# EAGLE schematic main (EAGLE 6.6.0)
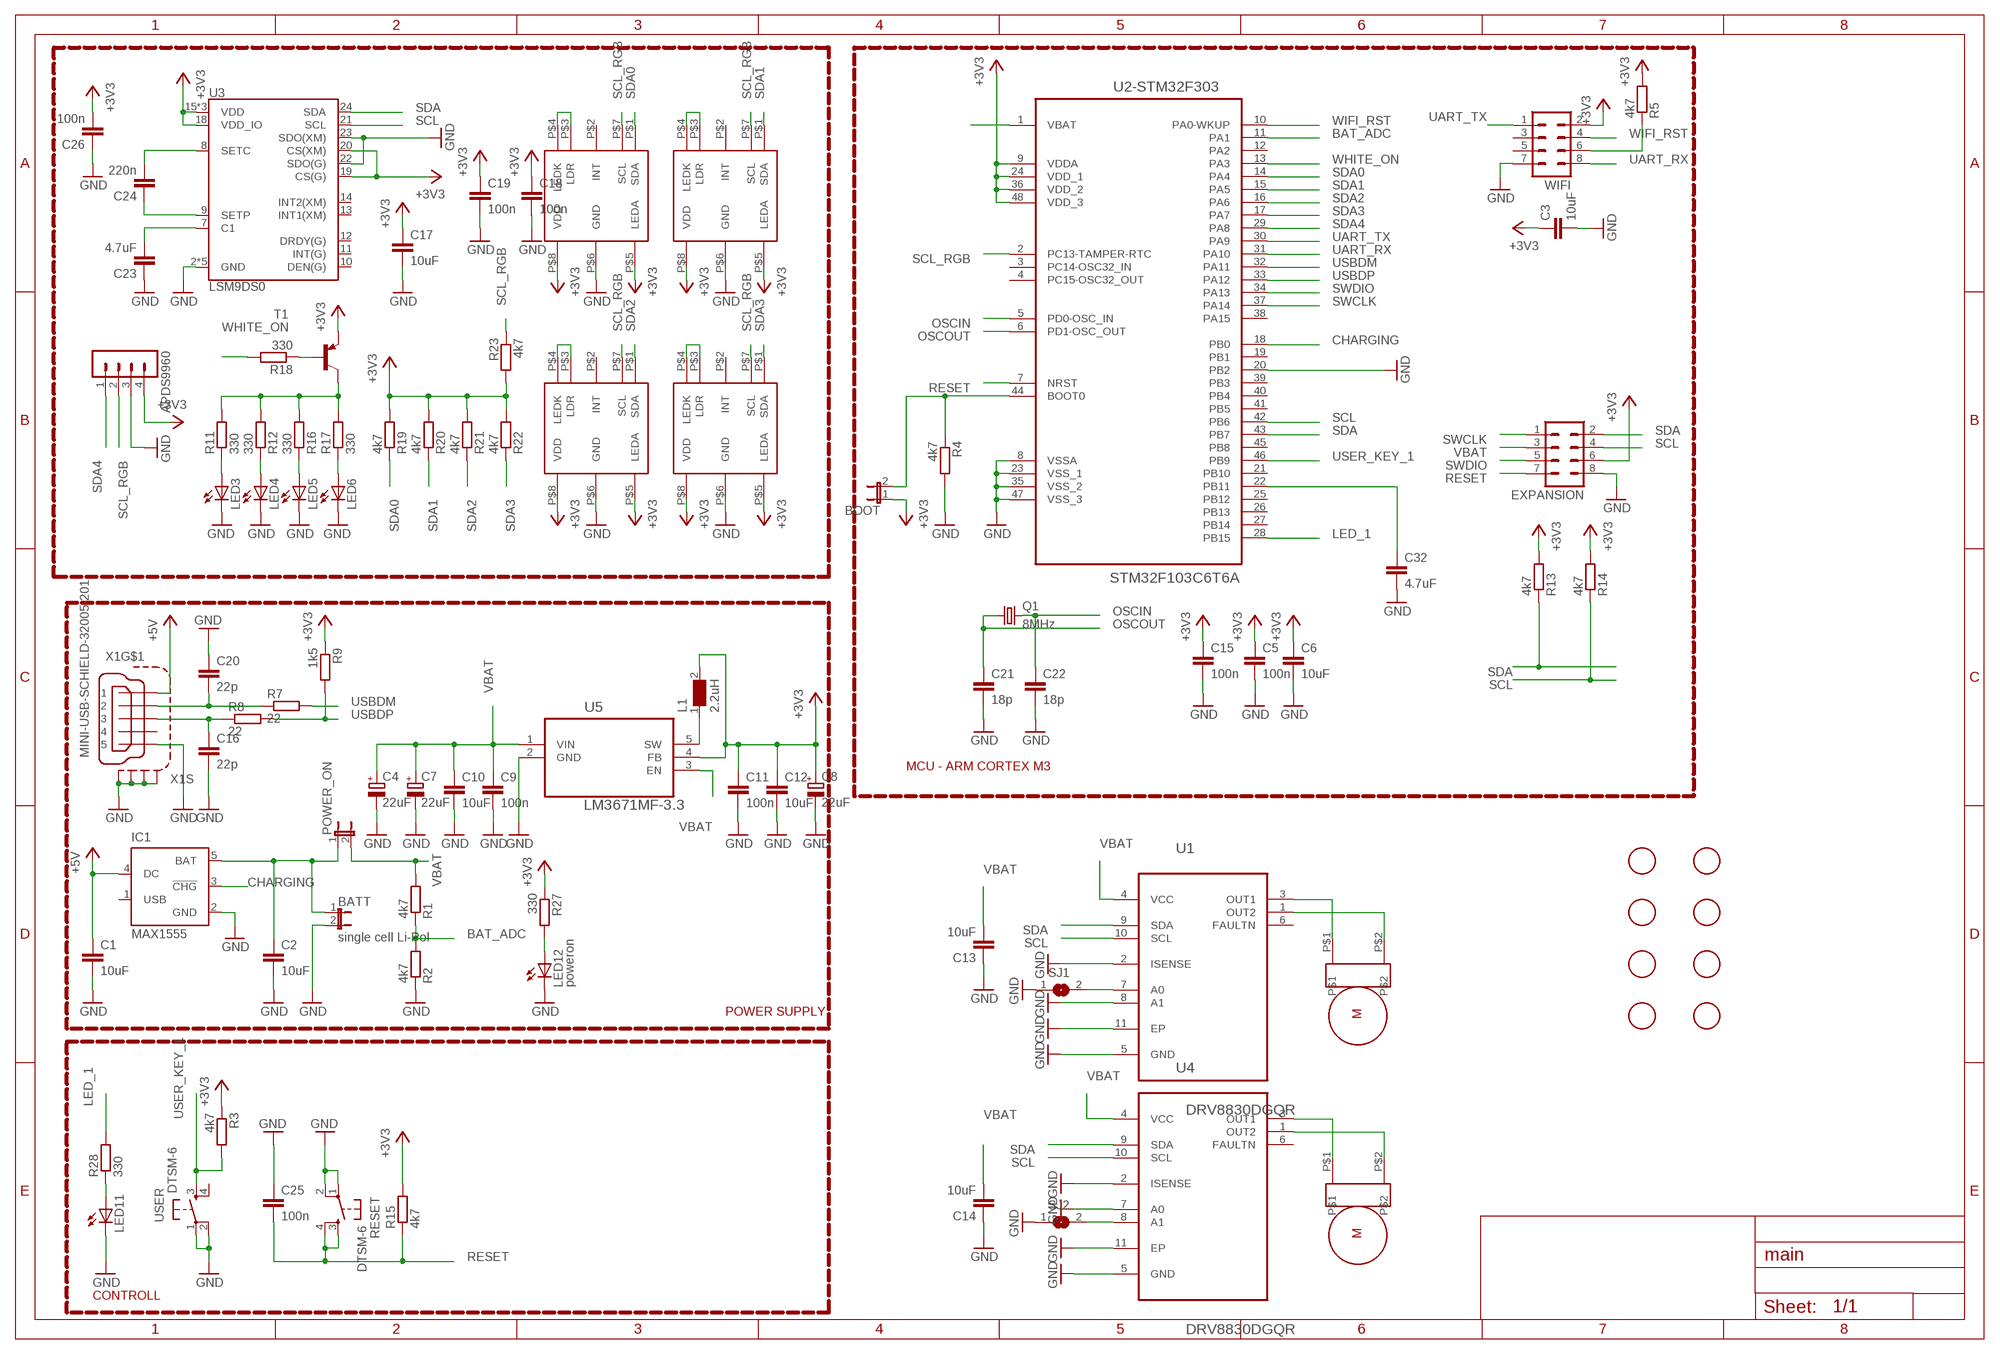
[diagram p0: schematic, sheet 1]

## Parts
APDS9960  MA04-1  [MA04-1]
BATT  single cell Li-Pol  JP1E  [JP1]
BOOT  JP1E  [JP1]
C1  10uF  C-EUC0805  [C0805]
C2  10uF  C-EUC0805  [C0805]
C3  10uF  C-EUC0805  [C0805]
C4  22uF  CPOL-EU153CLV-0505  [153CLV-0505]
C5  100n  C-EUC0805  [C0805]
C6  10uF  C-EUC0805  [C0805]
C7  22uF  CPOL-EU153CLV-0505  [153CLV-0505]
C8  22uF  CPOL-EU153CLV-0505  [153CLV-0505]
C9  100n  C-EUC0805  [C0805]
C10  10uF  C-EUC0805  [C0805]
C11  100n  C-EUC0805  [C0805]
C12  10uF  C-EUC0805  [C0805]
C13  10uF  C-EUC0805  [C0805]
C14  10uF  C-EUC0805  [C0805]
C15  100n  C-EUC0805  [C0805]
C16  22p  C-EUC0805  [C0805]
C17  10uF  C-EUC0805  [C0805]
C18  100n  C-EUC0805  [C0805]
C19  100n  C-EUC0805  [C0805]
C20  22p  C-EUC0805  [C0805]
C21  18p  C-EUC0805  [C0805]
C22  18p  C-EUC0805  [C0805]
C23  4.7uF  C-EUC0805  [C0805]
C24  220n  C-EUC0805  [C0805]
C25  100n  C-EUC0805  [C0805]
C26  100n  C-EUC0805  [C0805]
C32  4.7uF  C-EUC0805  [C0805]
EXPANSION  MA04-2  [MA04-2]
IC1  MAX1555  [SOT23-5L]
L1  2.2uH  WE-LQ-744032002_M  [WE-LQ_M]
LED3  LEDCHIPLED_1206  [CHIPLED_1206]
LED4  LEDCHIPLED_1206  [CHIPLED_1206]
LED5  LEDCHIPLED_1206  [CHIPLED_1206]
LED6  LEDCHIPLED_1206  [CHIPLED_1206]
LED11  LEDCHIPLED_1206  [CHIPLED_1206]
LED12  poweron  LEDCHIPLED_1206  [CHIPLED_1206]
POWER_ON  JP1E  [JP1]
Q1  8MHz  CRYSTALCTS406  [CTS406]
R1  4k7  R-EU_M0805  [M0805]
R2  4k7  R-EU_M0805  [M0805]
R3  4k7  R-EU_M1206  [M1206]
R4  4k7  R-EU_M0805  [M0805]
R5  4k7  R-EU_M0805  [M0805]
R7  22  R-EU_M0805  [M0805]
R8  22  R-EU_M0805  [M0805]
R9  1k5  R-EU_M0805  [M0805]
R11  330  R-EU_M0805  [M0805]
R12  330  R-EU_M0805  [M0805]
R13  4k7  R-EU_M0805  [M0805]
R14  4k7  R-EU_M0805  [M0805]
R15  4k7  R-EU_M0805  [M0805]
R16  330  R-EU_M0805  [M0805]
R17  330  R-EU_M0805  [M0805]
R18  330  R-EU_M0805  [M0805]
R19  4k7  R-EU_M0805  [M0805]
R20  4k7  R-EU_M0805  [M0805]
R21  4k7  R-EU_M0805  [M0805]
R22  4k7  R-EU_M0805  [M0805]
R23  4k7  R-EU_M0805  [M0805]
R27  330  R-EU_M0805  [M0805]
R28  330  R-EU_M0805  [M0805]
RESET  DTSM-6  [DTSM-6]
SJ1  SJ  [SJ]
SJ2  SJ  [SJ]
T1  BC857A-PNP-SOT23-BEC  [SOT23-BEC]
U1  DRV8830DGQR  [SOP65P640X110-15N]
U2-STM32F303  STM32F103C6T6A  [QFP50P900X900X160-48N]
U3  LSM9DS0  [LGA-24]
U4  DRV8830DGQR  [SOP65P640X110-15N]
U5  LM3671MF-3.3  [SOT95P284X122-5N]
U$1  APDS9950  [APDS9950]
U$2  APDS9950  [APDS9950]
U$3  APDS9950  [APDS9950]
U$4  APDS9950  [APDS9950]
U$5  MICRO_METAL_GEAR_MOTOR  [MICRO_METAL_GEAR_MOTOR]
U$6  MICRO_METAL_GEAR_MOTOR  [MICRO_METAL_GEAR_MOTOR]
U$9  FIDUCIAL  [FIDUCIAL_1MM]
U$10  FIDUCIAL  [FIDUCIAL_1MM]
U$11  FIDUCIAL  [FIDUCIAL_1MM]
U$12  FIDUCIAL  [FIDUCIAL_1MM]
U$13  FIDUCIAL  [FIDUCIAL_1MM]
U$14  FIDUCIAL  [FIDUCIAL_1MM]
U$15  FIDUCIAL  [FIDUCIAL_1MM]
U$16  FIDUCIAL  [FIDUCIAL_1MM]
USER  DTSM-6  [DTSM-6]
WIFI  MA04-2  [MA04-2]
X1  MINI-USB-SCHIELD-32005-201  [32005-201]

## Nets
+3V3: APDS9960.4 BOOT.1 C3.1 C5.1 C6.1 C8.+ C11.1 C12.1 C15.1 C17.1 C18.1 C19.1 C26.2 EXPANSION.6 L1.2 R3.1 R5.2 R9.1 R13.2 R14.2 R15.2 R19.2 R20.2 R21.2 R22.2 R23.2 R27.1 T1.E U2-STM32F303.9(VDDA) U2-STM32F303.24(VDD_1) U2-STM32F303.36(VDD_2) U2-STM32F303.48(VDD_3) U3.15(VDD) U3.16(VDD) U3.17(VDD) U3.18(VDD_IO) U3.19(CS(G)) U3.20(CS(XM)) U5.4(FB) U$1.P$5(LEDA) U$1.P$8(VDD) U$2.P$5(LEDA) U$2.P$8(VDD) U$3.P$5(LEDA) U$3.P$8(VDD) U$4.P$5(LEDA) U$4.P$8(VDD) WIFI.2
+5V: C1.1 IC1.4(DC) X1.1
BAT_ADC: R1.1 R2.2 U2-STM32F303.11(PA1)
CHARGING: IC1.3(!CHG) U2-STM32F303.18(PB0)
GND: APDS9960.3 BATT.2 C1.2 C2.2 C3.2 C4.- C5.2 C6.2 C7.- C8.- C9.2 C10.2 C11.2 C12.2 C13.1 C14.1 C15.2 C16.2 C17.2 C18.2 C19.2 C20.1 C21.2 C22.2 C23.1 C25.1 C26.1 C32.2 EXPANSION.8 IC1.2(GND) LED3.C LED4.C LED5.C LED6.C LED11.C LED12.C R2.1 R4.2 RESET.1 RESET.2 SJ1.1 SJ2.1 U1.2(ISENSE) U1.5(GND) U1.8(A1) U1.11(EP) U2-STM32F303.8(VSSA) U2-STM32F303.20(PB2) U2-STM32F303.23(VSS_1) U2-STM32F303.35(VSS_2) U2-STM32F303.47(VSS_3) U3.2(GND) U3.3(GND) U3.4(GND) U3.5(GND) U3.6(GND) U3.22(SDO(G)) U3.23(SDO(XM)) U4.2(ISENSE) U4.5(GND) U4.7(A0) U4.11(EP) U5.2(GND) U$1.P$6(GND) U$2.P$6(GND) U$3.P$6(GND) U$4.P$6(GND) USER.1 USER.2 WIFI.7 X1.5 X1.M1(S:S1) X1.M2(S:S2) X1.M3(S:S3) X1.M4(S:S4)
LED_1: R28.2 U2-STM32F303.28(PB15)
N$1: R5.1 WIFI.6
N$2: BATT.1 C2.1 IC1.5(BAT) POWER_ON.1
N$3: U1.1(OUT2) U$5.P$2
N$4: U1.3(OUT1) U$5.P$1
N$5: U4.1(OUT2) U$6.P$2
N$6: C23.2 U3.7(C1)
N$7: C24.2 U3.8(SETC)
N$8: U4.3(OUT1) U$6.P$1
N$9: L1.1 U5.5(SW)
N$13: C24.1 U3.9(SETP)
N$14: C32.1 U2-STM32F303.22(PB11)
N$15: LED3.A R11.1
N$16: BOOT.2 R4.1 U2-STM32F303.44(BOOT0)
N$17: U$1.P$3(LDR) U$1.P$4(LEDK)
N$18: U$2.P$3(LDR) U$2.P$4(LEDK)
N$19: U$3.P$3(LDR) U$3.P$4(LEDK)
N$20: U$4.P$3(LDR) U$4.P$4(LEDK)
N$21: SJ1.2 U1.7(A0)
N$22: LED4.A R12.1
N$23: LED12.A R27.2
N$24: LED5.A R16.1
N$25: LED6.A R17.1
N$26: R11.2 R12.2 R16.2 R17.2 T1.C
N$27: R18.1 T1.B
N$28: SJ2.2 U4.8(A1)
N$33: LED11.A R28.1
N$55: C20.2 R7.1 X1.2
N$56: C16.1 R8.1 X1.3
NC: U2-STM32F303.1(VBAT)
OSCIN: C22.1 Q1.3 U2-STM32F303.5(PD0-OSC_IN)
OSCOUT: C21.1 Q1.1 U2-STM32F303.6(PD1-OSC_OUT)
RESET: C25.2 EXPANSION.7 R15.1 RESET.3 RESET.4 U2-STM32F303.7(NRST)
SCL: EXPANSION.4 R14.1 U1.10(SCL) U2-STM32F303.42(PB6) U3.21(SCL) U4.10(SCL)
SCL_RGB: APDS9960.2 R23.1 U2-STM32F303.2(PC13-TAMPER-RTC) U$1.P$7(SCL) U$2.P$7(SCL) U$3.P$7(SCL) U$4.P$7(SCL)
SDA: EXPANSION.2 R13.1 U1.9(SDA) U2-STM32F303.43(PB7) U3.24(SDA) U4.9(SDA)
SDA0: R19.1 U2-STM32F303.14(PA4) U$1.P$1(SDA)
SDA1: R20.1 U2-STM32F303.15(PA5) U$2.P$1(SDA)
SDA2: R21.1 U2-STM32F303.16(PA6) U$3.P$1(SDA)
SDA3: R22.1 U2-STM32F303.17(PA7) U$4.P$1(SDA)
SDA4: APDS9960.1 U2-STM32F303.29(PA8)
SWCLK: EXPANSION.1 U2-STM32F303.37(PA14)
SWDIO: EXPANSION.5 U2-STM32F303.34(PA13)
UART_RX: U2-STM32F303.31(PA10) WIFI.8
UART_TX: U2-STM32F303.30(PA9) WIFI.1
USBDM: R7.2 U2-STM32F303.32(PA11)
USBDP: R8.2 R9.2 U2-STM32F303.33(PA12)
USER_KEY_1: R3.2 U2-STM32F303.46(PB9) USER.3
VBAT: C4.+ C7.+ C9.1 C10.1 C13.2 C14.2 EXPANSION.3 POWER_ON.2 R1.2 U1.4(VCC) U4.4(VCC) U5.1(VIN) U5.3(EN)
WHITE_ON: R18.2 U2-STM32F303.13(PA3)
WIFI_RST: U2-STM32F303.10(PA0-WKUP) WIFI.4
Unconnected: IC1.1(USB) U1.6(FAULTN) U2-STM32F303.3(PC14-OSC32_IN) U2-STM32F303.4(PC15-OSC32_OUT) U2-STM32F303.12(PA2) U2-STM32F303.19(PB1) U2-STM32F303.21(PB10) U2-STM32F303.25(PB12) U2-STM32F303.26(PB13) U2-STM32F303.27(PB14) U2-STM32F303.38(PA15) U2-STM32F303.39(PB3) U2-STM32F303.40(PB4) U2-STM32F303.41(PB5) U2-STM32F303.45(PB8) U3.10(DEN(G)) U3.11(INT(G)) U3.12(DRDY(G)) U3.13(INT1(XM)) U3.14(INT2(XM)) U4.6(FAULTN) U$1.P$2(INT) U$2.P$2(INT) U$3.P$2(INT) U$4.P$2(INT) USER.4 WIFI.3 WIFI.5 X1.4

## Notes on the sheet
- MCU - ARM CORTEX M3
- POWER SUPPLY
- CONTROLL

## Library data of the parts
APDS9960 = con-lstb:MA04-1: PIN HEADER; OC_FARNELL: unknown; OC_NEWARK: unknown
BATT BOOT POWER_ON = jumper:JP1E: JUMPER
C1-C3 C5 C6 C9-C26 C32 = resistor:C-EU: CAPACITOR, European symbol
C4 C7 C8 = resistor:CPOL-EU: POLARIZED CAPACITOR, European symbol
EXPANSION WIFI = con-lstb:MA04-2: PIN HEADER; OC_FARNELL: unknown; OC_NEWARK: unknown
IC1 = maxim:MAX1555: Dual-Input USB/AC Adapter 1-Cell Li+ Battery Chargers Source: http://www.maxim-ic.com .. MAX1551-MAX1555.pdf; MF: MAXIM; MPN: MAX1555EZK+T; OC_FARNELL: 1628222; OC_NEWARK: 59J2761
L1 = WE-LQ:WE-LQ: SMD RF Inductor WE-LQ - High Q at high frequences - Low DC-resistance - Miniature chip inductor wound on a special ferrite core -- Low power DC/DC-converters from Linear Technology, National Semiconductor, Texas Instruments and Fairchild Semiconductor ect. -- Test & measurement equipment -- EMI-Filtering -- RF-circuit; MPN: 744032002; OC_FARNELL: 1800378; OC_NEWARK: 78R5670; PACKAGE: 1210; SUPPLIER: WURTH ELEKTRONIK
LED3-LED6 LED11 LED12 = led:LED: LED OSRAM: - CHIPLED LG R971, LG N971, LY N971, LG Q971, LY Q971, LO R971, LY R971 LH N974, LH R974 LS Q976, LO Q976, LY Q976 LO Q996 - Hyper CHIPLED LW Q18S LB Q993, LB Q99A, LB R99A - SideLED LS A670, LO A670, LY A670, LG A670, LP A670 LB A673, LV A673, LT A673, LW A673 LH A674 LY A675 LS A676, LA A676, LO A676, LY A676, LW A676 LS A679, LY A679, LG A679 - Hyper Micro SIDELED® LS Y876, LA Y876, LO Y876, LY Y876 LT Y87S - SmartLED LW L88C, LW L88S LB L89C, LB L89S, LG L890 LS L89K, LO L89K, LY L89K LS L896, LA L896, LO L896, LY L896 - TOPLED LS T670, LO T670, LY T670, LG T670, LP T670 LSG T670, LSP T670, LSY T670, LOP T670, LYG T670 LG T671, LOG T671, LSG T671 LB T673, LV T673, LT T673, LW T673 LH T674 LS T676, LA T676, LO T676, LY T676, LB T676, LH T676, LSB T676, LW T676 LB T67C, LV T67C, LT T67C, LS T67K, LO T67K, LY T67K, LW E67C LS E67B, LA E67B, LO E67B, LY E67B, LB E67C, LV E67C, LT E67C LW T67C LS T679, LY T679, LG T679 LS T770, LO T770, LY T770, LG T770, LP T770 LB T773, LV T773, LT T773, LW T773 LH T774 LS E675, LA E675, LY E675, LS T675 LS T776, LA T776, LO T776, LY T776, LB T776 LHGB T686 LT T68C, LB T68C - Hyper Mini TOPLED® LB M676 - Mini TOPLED Santana® LG M470 LS M47K, LO M47K, LY M47K Source: http://www.osram.convergy.de LUXEON: - LUMILED® LXK2-PW12-R00, LXK2-PW12-S00, LXK2-PW14-U00, LXK2-PW14-V00 LXK2-PM12-R00, LXK2-PM12-S00, LXK2-PM14-U00 LXK2-PE12-Q00, LXK2-PE12-R00, LXK2-PE12-S00, LXK2-PE14-T00, LXK2-PE14-U00 LXK2-PB12-K00, LXK2-PB12-L00, LXK2-PB12-M00, LXK2-PB14-N00, LXK2-PB14-P00, LXK2-PB14-Q00 LXK2-PR12-L00, LXK2-PR12-M00, LXK2-PR14-Q00, LXK2-PR14-R00 LXK2-PD12-Q00, LXK2-PD12-R00, LXK2-PD12-S00 LXK2-PH12-R00, LXK2-PH12-S00 LXK2-PL12-P00, LXK2-PL12-Q00, LXK2-PL12-R00 Source: www.luxeon.com KINGBRIGHT: KA-3528ASYC Source: www.kingbright.com
Q1 = crystal:CRYSTAL: CRYSTAL; OC_FARNELL: unknown; OC_NEWARK: unknown
R1-R5 R7-R9 R11-R23 R27 R28 = resistor:R-EU_: RESISTOR, European symbol
RESET USER = switch-tact:DTSM-6
SJ1 SJ2 = jumper:SJ: SMD solder JUMPER
T1 = my_parts:*-PNP-: PNP Transistror
U1 U4 = my_parts:DRV8830DGQR: LOW-VOLTAGE MOTOR DRIVER WITH SERIAL INTERFACE; MPN: DRV8830DGQR; OC_FARNELL: 1863106; OC_NEWARK: 58T1482; PACKAGE: MSOP-10; SUPPLIER: TEXAS INSTRUMENTS
U2-STM32F303 = stm32f103_lqfp48:STM32F103C6T6A: MCU, 32BIT, 32K FLASH, 48LQFP; MPN: STM32F103C6T6A; OC_FARNELL: 1972391; OC_NEWARK: 72T2643; PACKAGE: 48LQFP; SUPPLIER: STMicroelectronics
U3 = main:LSM9DS0: LSM9DS0 3D Accelerometer, 3D Gyroscope, 3D Magnetomter Features: 3 acceleration channels, 3 angular rate channels, 3 magnetic field channels ±2/±4/±6/±8/±16 g linear acceleration full scale ±2/±4/±8/±12 gauss magnetic full scale ±245/±500/±2000 dps angular rate full scale 16-bit data output SPI / I2C serial interfaces Analog supply voltage 2.4 V to 3.6 V Power-down mode / low-power mode Programmable interrupt generators Embedded self-test Embedded temperature sensor Embedded FIFO Position and motion detection functions Click/double-click recognition
U5 = my_parts:LM3671MF-3.3: IC BUCK SYNC 3.3V 0.6A; MPN: LM3671MF-3.3; OC_FARNELL: 1685767; OC_NEWARK: 79K7838; PACKAGE: 5-SOT-23; SUPPLIER: NationalSemiconductor
U$1-U$4 = my_parts:APDS9950
U$5 U$6 = pololu:MICRO_METAL_GEAR_MOTOR
U$9-U$16 = adafruit:FIDUCIAL: For use by pick and place machines to calibrate the vision/machine, 1mm By microbuilder.eu
X1 = con-cypressindustries:MINI-USB-SCHIELD-: MINI USB-B Conector Source: www.cypressindustries.com; OC_FARNELL: unknown; OC_NEWARK: unknown